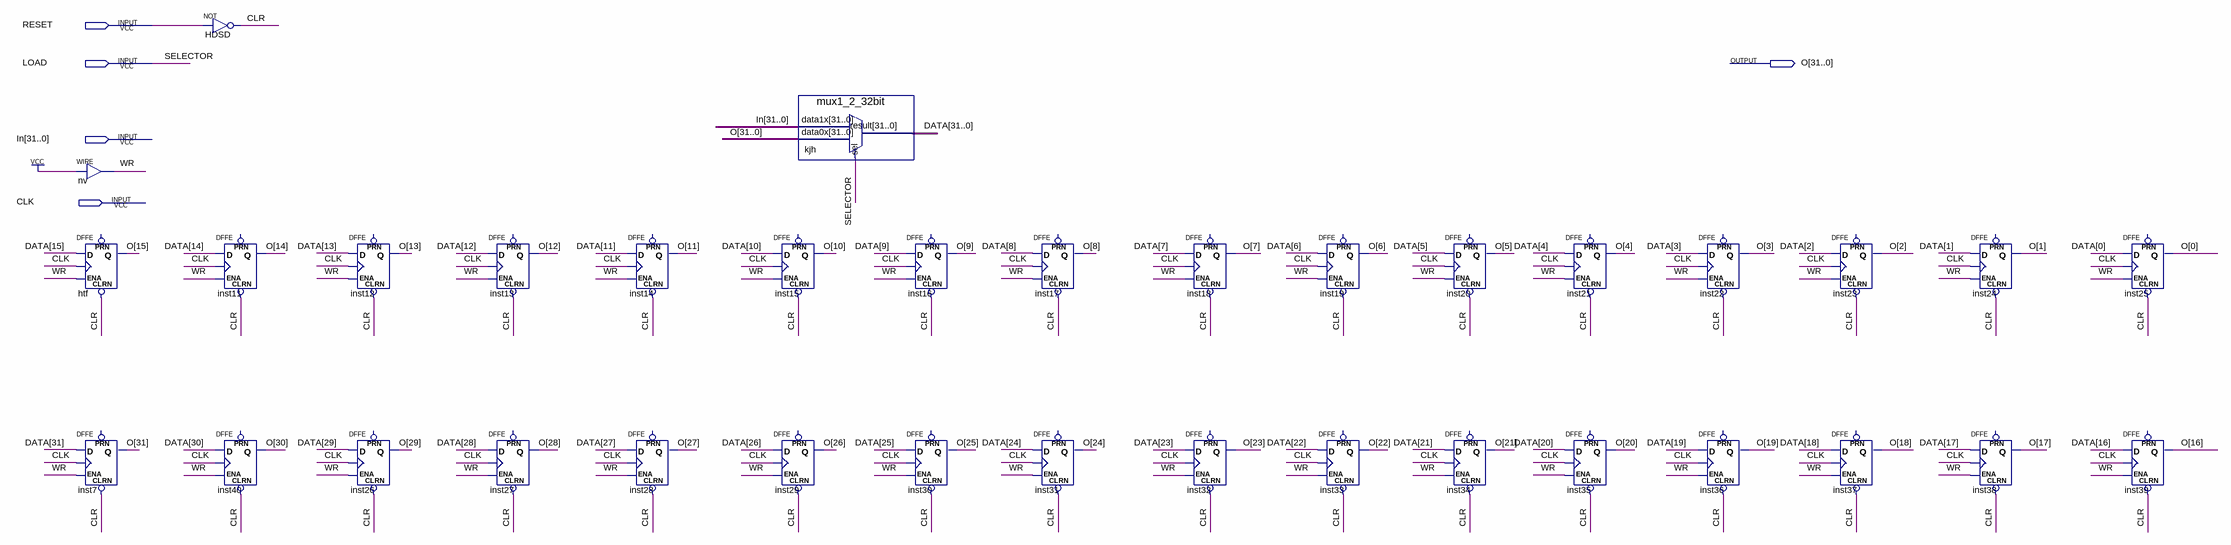
[diagram p0: schematic sheet]
// Quartus schematic REG_32withLD.bdf as structural Verilog: 35 symbols, 5 pins
module REG_32withLD (
  input  RESET,
  input  LOAD,
  input  [31:0] In,
  input  CLK,
  output [31:0] O
);

  wire CLR, WR;
  wire [31:0] DATA;

  assign WR = 1'b1;  // WIRE nv
  DFFE htf (.CLRN(CLR), .D(DATA[15]), .CLK(CLK), .ENA(WR), .Q(O[15]));  // open: PRN
  DFFE inst7 (.CLRN(CLR), .D(DATA[31]), .CLK(CLK), .ENA(WR), .Q(O[31]));  // open: PRN
  not HDSD (CLR, RESET);
  DFFE inst11 (.CLRN(CLR), .D(DATA[14]), .CLK(CLK), .ENA(WR), .Q(O[14]));  // open: PRN
  DFFE inst40 (.CLRN(CLR), .D(DATA[30]), .CLK(CLK), .ENA(WR), .Q(O[30]));  // open: PRN
  DFFE inst12 (.CLRN(CLR), .D(DATA[13]), .CLK(CLK), .ENA(WR), .Q(O[13]));  // open: PRN
  DFFE inst26 (.CLRN(CLR), .D(DATA[29]), .CLK(CLK), .ENA(WR), .Q(O[29]));  // open: PRN
  DFFE inst13 (.CLRN(CLR), .D(DATA[12]), .CLK(CLK), .ENA(WR), .Q(O[12]));  // open: PRN
  DFFE inst27 (.CLRN(CLR), .D(DATA[28]), .CLK(CLK), .ENA(WR), .Q(O[28]));  // open: PRN
  DFFE inst14 (.CLRN(CLR), .D(DATA[11]), .CLK(CLK), .ENA(WR), .Q(O[11]));  // open: PRN
  DFFE inst28 (.CLRN(CLR), .D(DATA[27]), .CLK(CLK), .ENA(WR), .Q(O[27]));  // open: PRN
  mux1_2_32bit kjh (.data1x(In), .data0x(O), .sel(LOAD), .result(DATA));
  DFFE inst15 (.CLRN(CLR), .D(DATA[10]), .CLK(CLK), .ENA(WR), .Q(O[10]));  // open: PRN
  DFFE inst29 (.CLRN(CLR), .D(DATA[26]), .CLK(CLK), .ENA(WR), .Q(O[26]));  // open: PRN
  DFFE inst16 (.CLRN(CLR), .D(DATA[9]), .CLK(CLK), .ENA(WR), .Q(O[9]));  // open: PRN
  DFFE inst30 (.CLRN(CLR), .D(DATA[25]), .CLK(CLK), .ENA(WR), .Q(O[25]));  // open: PRN
  DFFE inst17 (.CLRN(CLR), .D(DATA[8]), .CLK(CLK), .ENA(WR), .Q(O[8]));  // open: PRN
  DFFE inst31 (.CLRN(CLR), .D(DATA[24]), .CLK(CLK), .ENA(WR), .Q(O[24]));  // open: PRN
  DFFE inst18 (.CLRN(CLR), .D(DATA[7]), .CLK(CLK), .ENA(WR), .Q(O[7]));  // open: PRN
  DFFE inst32 (.CLRN(CLR), .D(DATA[23]), .CLK(CLK), .ENA(WR), .Q(O[23]));  // open: PRN
  DFFE inst19 (.CLRN(CLR), .D(DATA[6]), .CLK(CLK), .ENA(WR), .Q(O[6]));  // open: PRN
  DFFE inst33 (.CLRN(CLR), .D(DATA[22]), .CLK(CLK), .ENA(WR), .Q(O[22]));  // open: PRN
  DFFE inst20 (.CLRN(CLR), .D(DATA[5]), .CLK(CLK), .ENA(WR), .Q(O[5]));  // open: PRN
  DFFE inst34 (.CLRN(CLR), .D(DATA[21]), .CLK(CLK), .ENA(WR), .Q(O[21]));  // open: PRN
  DFFE inst21 (.CLRN(CLR), .D(DATA[4]), .CLK(CLK), .ENA(WR), .Q(O[4]));  // open: PRN
  DFFE inst35 (.CLRN(CLR), .D(DATA[20]), .CLK(CLK), .ENA(WR), .Q(O[20]));  // open: PRN
  DFFE inst22 (.CLRN(CLR), .D(DATA[3]), .CLK(CLK), .ENA(WR), .Q(O[3]));  // open: PRN
  DFFE inst36 (.CLRN(CLR), .D(DATA[19]), .CLK(CLK), .ENA(WR), .Q(O[19]));  // open: PRN
  DFFE inst23 (.CLRN(CLR), .D(DATA[2]), .CLK(CLK), .ENA(WR), .Q(O[2]));  // open: PRN
  DFFE inst37 (.CLRN(CLR), .D(DATA[18]), .CLK(CLK), .ENA(WR), .Q(O[18]));  // open: PRN
  DFFE inst24 (.CLRN(CLR), .D(DATA[1]), .CLK(CLK), .ENA(WR), .Q(O[1]));  // open: PRN
  DFFE inst38 (.CLRN(CLR), .D(DATA[17]), .CLK(CLK), .ENA(WR), .Q(O[17]));  // open: PRN
  DFFE inst25 (.CLRN(CLR), .D(DATA[0]), .CLK(CLK), .ENA(WR), .Q(O[0]));  // open: PRN
  DFFE inst39 (.CLRN(CLR), .D(DATA[16]), .CLK(CLK), .ENA(WR), .Q(O[16]));  // open: PRN

  // Other names for the same wires on the sheet: SELECTOR = LOAD
endmodule
